# EAGLE design sensorbridge (EAGLE 8.2.2)
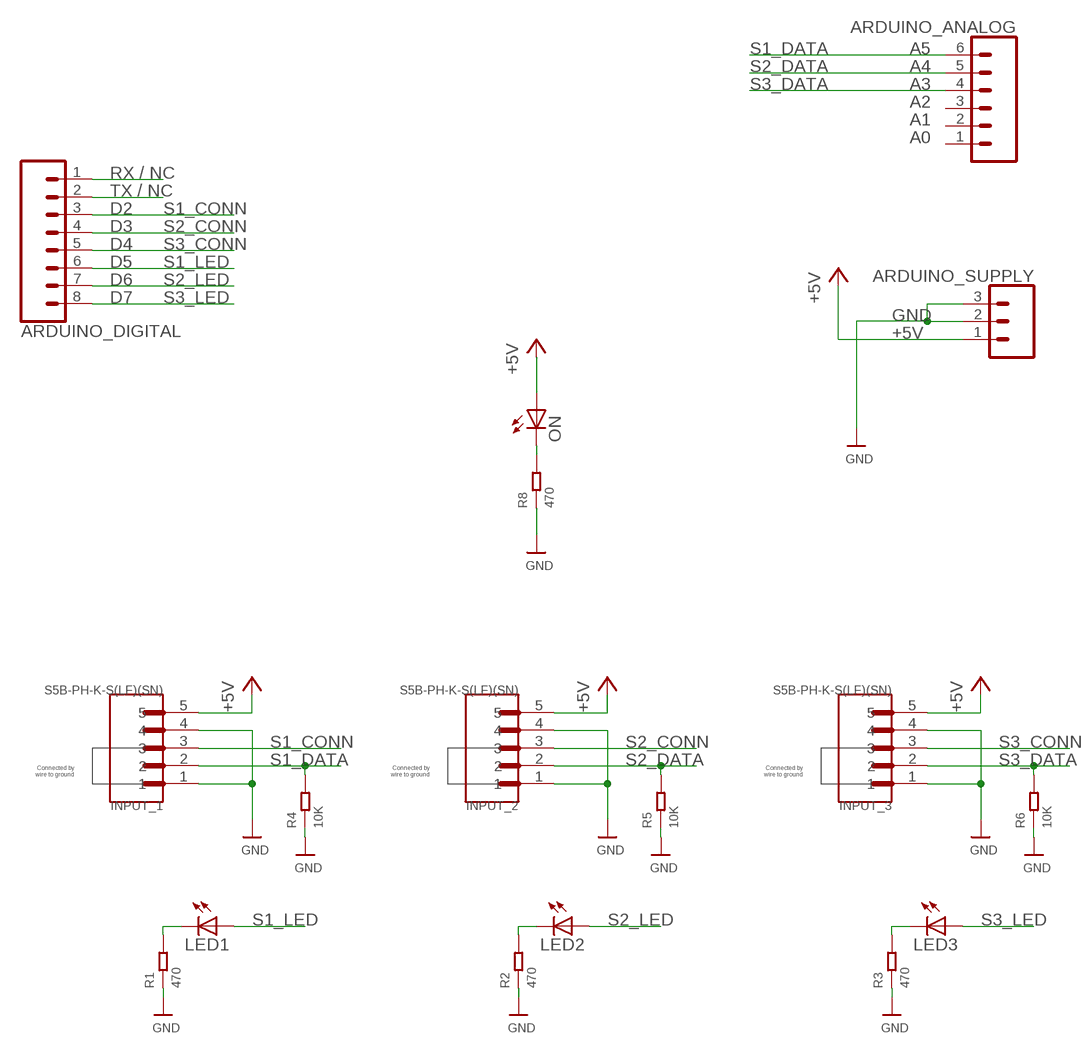
[diagram p0: schematic, sheet 1]

## Parts
ARDUINO_ANALOG  CONN_06NO_SILK_FEMALE_PTH  [1X06_NO_SILK]
ARDUINO_DIGITAL  CONN_08NO_SILK_FEMALE_PTH  [1X08_NO_SILK]
ARDUINO_SUPPLY  CONN_031X03_NO_SILK  [1X03_NO_SILK]
INPUT_1  S5B-PH-K-S(LF)(SN)  [JST_S5B-PH-K-S(LF)(SN)]
INPUT_2  S5B-PH-K-S(LF)(SN)  [JST_S5B-PH-K-S(LF)(SN)]
INPUT_3  S5B-PH-K-S(LF)(SN)  [JST_S5B-PH-K-S(LF)(SN)]
LED1  LEDCHIP-LED0603  [CHIP-LED0603]
LED2  LEDCHIP-LED0603  [CHIP-LED0603]
LED3  LEDCHIP-LED0603  [CHIP-LED0603]
ON  LEDCHIP-LED0603  [CHIP-LED0603]
R1  470  RES-0603  [R0603]
R2  470  RES-0603  [R0603]
R3  470  RES-0603  [R0603]
R4  10K  RES-0603  [R0603]
R5  10K  RES-0603  [R0603]
R6  10K  RES-0603  [R0603]
R8  470  RES-0603  [R0603]

## Nets
+5V: ARDUINO_SUPPLY.1 INPUT_1.5 INPUT_2.5 INPUT_3.5 ON.A
GND: ARDUINO_SUPPLY.2 ARDUINO_SUPPLY.3 INPUT_1.1 INPUT_1.4 INPUT_2.1 INPUT_2.4 INPUT_3.1 INPUT_3.4 R1.1 R2.1 R3.1 R4.1 R5.1 R6.1 R8.1
N$1: LED1.C R1.2
N$2: LED2.C R2.2
N$3: LED3.C R3.2
N$9: ON.C R8.2
N$12: ARDUINO_DIGITAL.2
N$13: ARDUINO_DIGITAL.1
S1_CONN: ARDUINO_DIGITAL.3 INPUT_1.3
S1_DATA: ARDUINO_ANALOG.6 INPUT_1.2 R4.2
S1_LED: ARDUINO_DIGITAL.6 LED1.A
S2_CONN: ARDUINO_DIGITAL.4 INPUT_2.3
S2_DATA: ARDUINO_ANALOG.5 INPUT_2.2 R5.2
S2_LED: ARDUINO_DIGITAL.7 LED2.A
S3_CONN: ARDUINO_DIGITAL.5 INPUT_3.3
S3_DATA: ARDUINO_ANALOG.4 INPUT_3.2 R6.2
S3_LED: ARDUINO_DIGITAL.8 LED3.A
Unconnected: ARDUINO_ANALOG.1 ARDUINO_ANALOG.2 ARDUINO_ANALOG.3

## Notes on the sheet
- A5
- A4
- A3
- A2
- A1
- A0
- RX / NC
- TX / NC
- D2
- D3
- D4
- D5
- D6
- D7
- Connected by
  wire to ground
- Connected by
  wire to ground
- Connected by
  wire to ground

## Library data of the parts
ARDUINO_ANALOG = SparkFun-Connectors:CONN_06: Multi connection point. Often used as Generic Header-pin footprint for 0.1 inch spaced/style header connections On any of the 0.1 inch spaced packages, you can populate with these: Break Away Headers - Straight <https://www.sparkfun.com/products/116> (PRT-00116) Break Away Male Headers - Right Angle <https://www.sparkfun.com/products/553> (PRT-00553) Female Headers <https://www.sparkfun.com/products/115> (PRT-00115) Break Away Headers - Machine Pin <https://www.sparkfun.com/products/117> (PRT-00117) Break Away Female Headers - Swiss Machine Pin <https://www.sparkfun.com/products/743> (PRT-00743) Arduino Stackable Header - 6 Pin <https://www.sparkfun.com/products/9280> (PRT-09280) For SCREWTERMINALS and SPRING TERMINALS visit here: Screw Terimnals on SparkFun.com <https://www.sparkfun.com/search/results?term=Screw+Terminals> (5mm/3.5mm/2.54mm spacing) This device is also useful as a general connection point to wire up your design to another part of your project. Our various solder wires solder well into these plated through hole pads. Hook-Up Wire - Assortment (Stranded, 22 AWG) <https://www.sparkfun.com/products/11375> (PRT-11375) Hook-Up Wire - Assortment (Solid Core, 22 AWG) <https://www.sparkfun.com/products/11367> (PRT-11367) View the entire wire category on our website here <https://www.sparkfun.com/categories/141>; PROD_ID: CONN-08437
ARDUINO_DIGITAL = SparkFun-Connectors:CONN_08: Multi connection point. Often used as Generic Header-pin footprint for 0.1 inch spaced/style header connections On any of the 0.1 inch spaced packages, you can populate with these: Break Away Headers - Straight <https://www.sparkfun.com/products/116> (PRT-00116) Break Away Male Headers - Right Angle <https://www.sparkfun.com/products/553> (PRT-00553) Female Headers <https://www.sparkfun.com/products/115> (PRT-00115) Break Away Headers - Machine Pin <https://www.sparkfun.com/products/117> (PRT-00117) Break Away Female Headers - Swiss Machine Pin <https://www.sparkfun.com/products/743> (PRT-00743) Arduino Stackable Header - 8 Pin <https://www.sparkfun.com/products/9279> (PRT-09279) For SCREWTERMINALS and SPRING TERMINALS visit here: Screw Terimnals on SparkFun.com <https://www.sparkfun.com/search/results?term=Screw+Terminals> (5mm/3.5mm/2.54mm spacing) This device is also useful as a general connection point to wire up your design to another part of your project. Our various solder wires solder well into these plated through hole pads. Hook-Up Wire - Assortment (Stranded, 22 AWG) <https://www.sparkfun.com/products/11375> (PRT-11375) Hook-Up Wire - Assortment (Solid Core, 22 AWG) <https://www.sparkfun.com/products/11367> (PRT-11367) View the entire wire category on our website here <https://www.sparkfun.com/categories/141> Special notes: Molex polarized connector foot print use with SKU : PRT-08231 with associated crimp pins and housings. 1MM SMD Version SKU: PRT-10208 NOTES ON THE VARIANTS LOCK and LOCK_LONGPADS... This footprint was designed to help hold the alignment of a through-hole component (i.e. 6-pin header) while soldering it into place. You may notice that each hole has been shifted either up or down by 0.005 of an inch from it's more standard position (which is a perfectly straight line). This slight alteration caused the pins (the squares in the middle) to touch the edges of the holes. Because they are alternating, it causes a "brace" to hold the component in place. 0.005 has proven to be the perfect amount of "off-center" position when using our standard breakaway headers. Although looks a little odd when you look at the bare footprint, once you have a header in there, the alteration is very hard to notice. Also,if you push a header all the way into place, it is covered up entirely on the bottom side.; PROD_ID: CONN-08438
ARDUINO_SUPPLY = SparkFun-Connectors:CONN_03: Multi connection point. Often used as Generic Header-pin footprint for 0.1 inch spaced/style header connections On any of the 0.1 inch spaced packages, you can populate with these: Break Away Headers - Straight <https://www.sparkfun.com/products/116> (PRT-00116) Break Away Male Headers - Right Angle <https://www.sparkfun.com/products/553> (PRT-00553) Female Headers <https://www.sparkfun.com/products/115> (PRT-00115) Break Away Headers - Machine Pin <https://www.sparkfun.com/products/117> (PRT-00117) Break Away Female Headers - Swiss Machine Pin <https://www.sparkfun.com/products/743> (PRT-00743) Stackable Header - 3 Pin (Female, 0.1") <https://www.sparkfun.com/products/13875> (PRT-13875) For SCREWTERMINALS and SPRING TERMINALS visit here: Screw Terimnals on SparkFun.com <https://www.sparkfun.com/search/results?term=Screw+Terminals> (5mm/3.5mm/2.54mm spacing) This device is also useful as a general connection point to wire up your design to another part of your project. Our various solder wires solder well into these plated through hole pads. Hook-Up Wire - Assortment (Stranded, 22 AWG) <https://www.sparkfun.com/products/11375> (PRT-11375) Hook-Up Wire - Assortment (Solid Core, 22 AWG) <https://www.sparkfun.com/products/11367> (PRT-11367) View the entire wire category on our website here <https://www.sparkfun.com/categories/141> Special notes: Molex polarized connector foot print use with SKU : PRT-08232 with associated crimp pins and housings.
INPUT_1-INPUT_3 = S5B-PH-K-S_LF__SN_:S5B-PH-K-S(LF)(SN): PH Series 5 Position 2 mm Pitch Through Hole Side Entry Shrouded Header; AVAILABILITY: Good; DESCRIPTION: PH Series 5 Position 2 mm Pitch Through Hole Side Entry Shrouded Header; MF: JST; MP: S5B-PH-K-S(LF)(SN); PACKAGE: None; PRICE: 0.15 USD
LED1-LED3 ON = adafruit:LED: LED OSRAM: - CHIPLED LG R971, LG N971, LY N971, LG Q971, LY Q971, LO R971, LY R971 LH N974, LH R974 LS Q976, LO Q976, LY Q976 LO Q996 - Hyper CHIPLED LW Q18S LB Q993, LB Q99A, LB R99A - SideLED LS A670, LO A670, LY A670, LG A670, LP A670 LB A673, LV A673, LT A673, LW A673 LH A674 LY A675 LS A676, LA A676, LO A676, LY A676, LW A676 LS A679, LY A679, LG A679 - Hyper Micro SIDELED® LS Y876, LA Y876, LO Y876, LY Y876 LT Y87S - SmartLED LW L88C, LW L88S LB L89C, LB L89S, LG L890 LS L89K, LO L89K, LY L89K LS L896, LA L896, LO L896, LY L896 - TOPLED LS T670, LO T670, LY T670, LG T670, LP T670 LSG T670, LSP T670, LSY T670, LOP T670, LYG T670 LG T671, LOG T671, LSG T671 LB T673, LV T673, LT T673, LW T673 LH T674 LS T676, LA T676, LO T676, LY T676, LB T676, LH T676, LSB T676, LW T676 LB T67C, LV T67C, LT T67C, LS T67K, LO T67K, LY T67K, LW E67C LS E67B, LA E67B, LO E67B, LY E67B, LB E67C, LV E67C, LT E67C LW T67C LS T679, LY T679, LG T679 LS T770, LO T770, LY T770, LG T770, LP T770 LB T773, LV T773, LT T773, LW T773 LH T774 LS E675, LA E675, LY E675, LS T675 LS T776, LA T776, LO T776, LY T776, LB T776 LHGB T686 LT T68C, LB T68C - Hyper Mini TOPLED® LB M676 - Mini TOPLED Santana® LG M470 LS M47K, LO M47K, LY M47K Source: http://www.osram.convergy.de/
R1-R6 R8 = Seeed-OPL-Resistor:RES

## Board
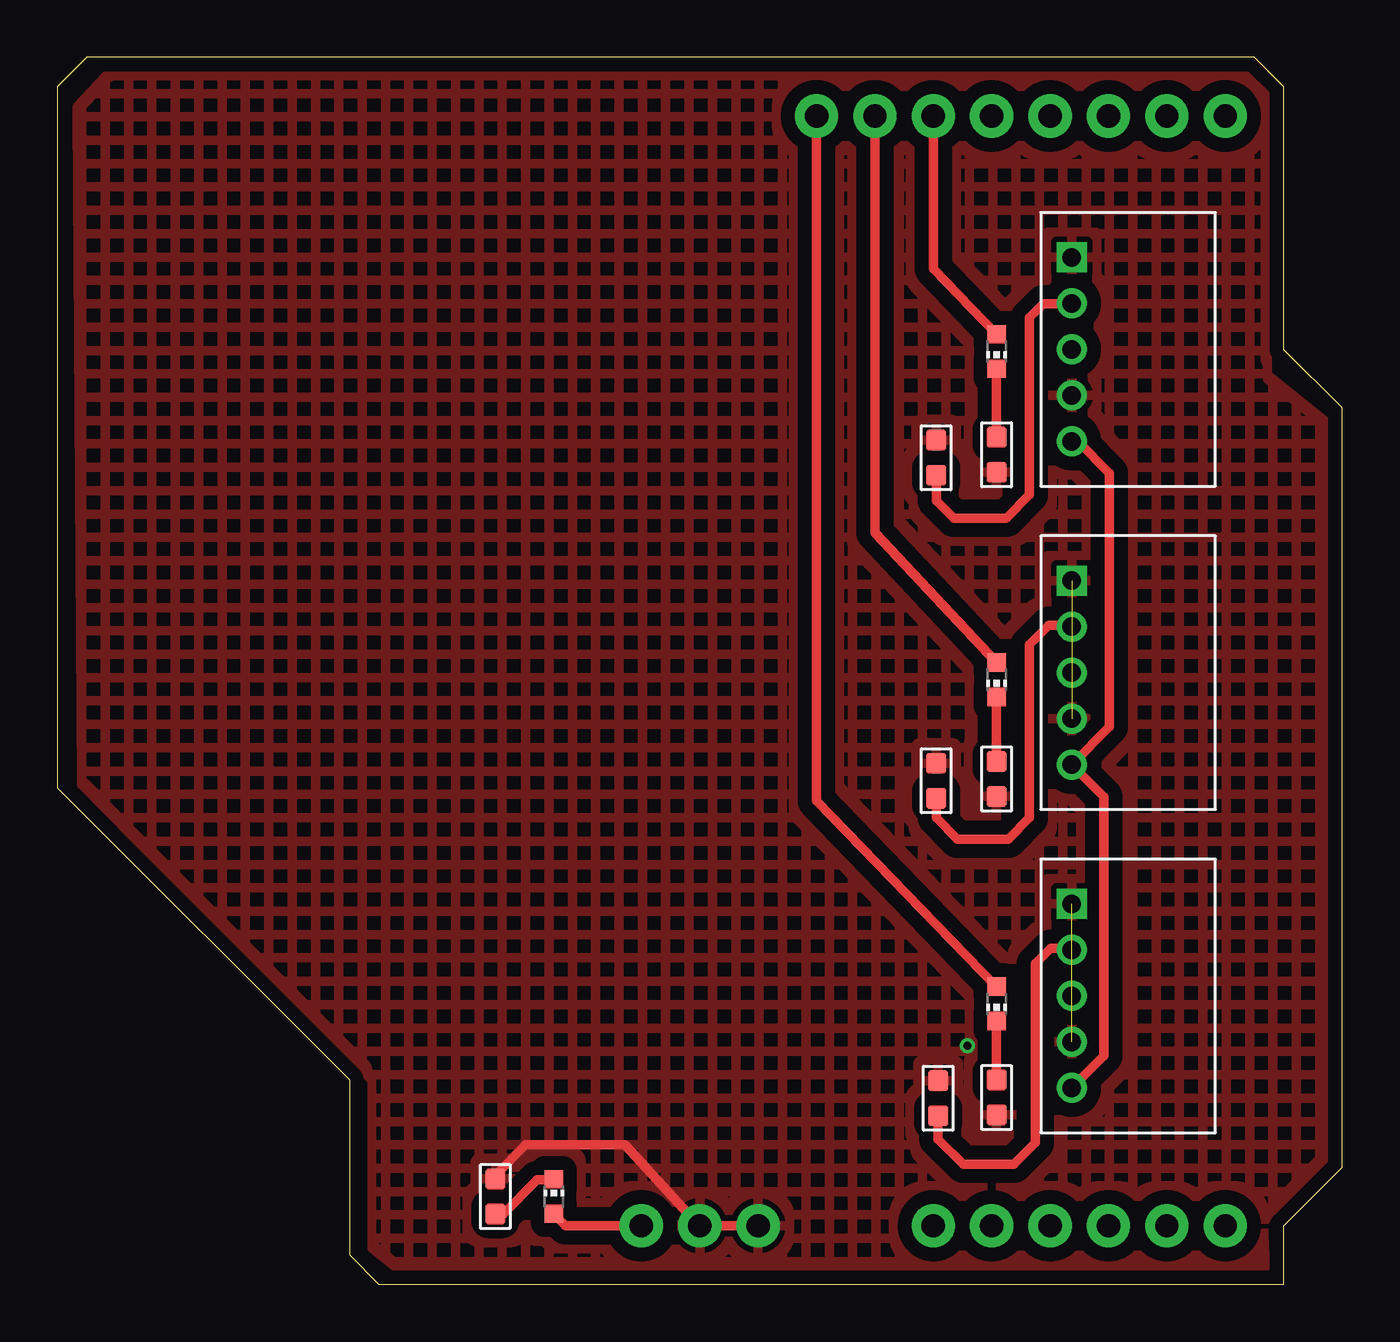
[diagram p1: board, top side]
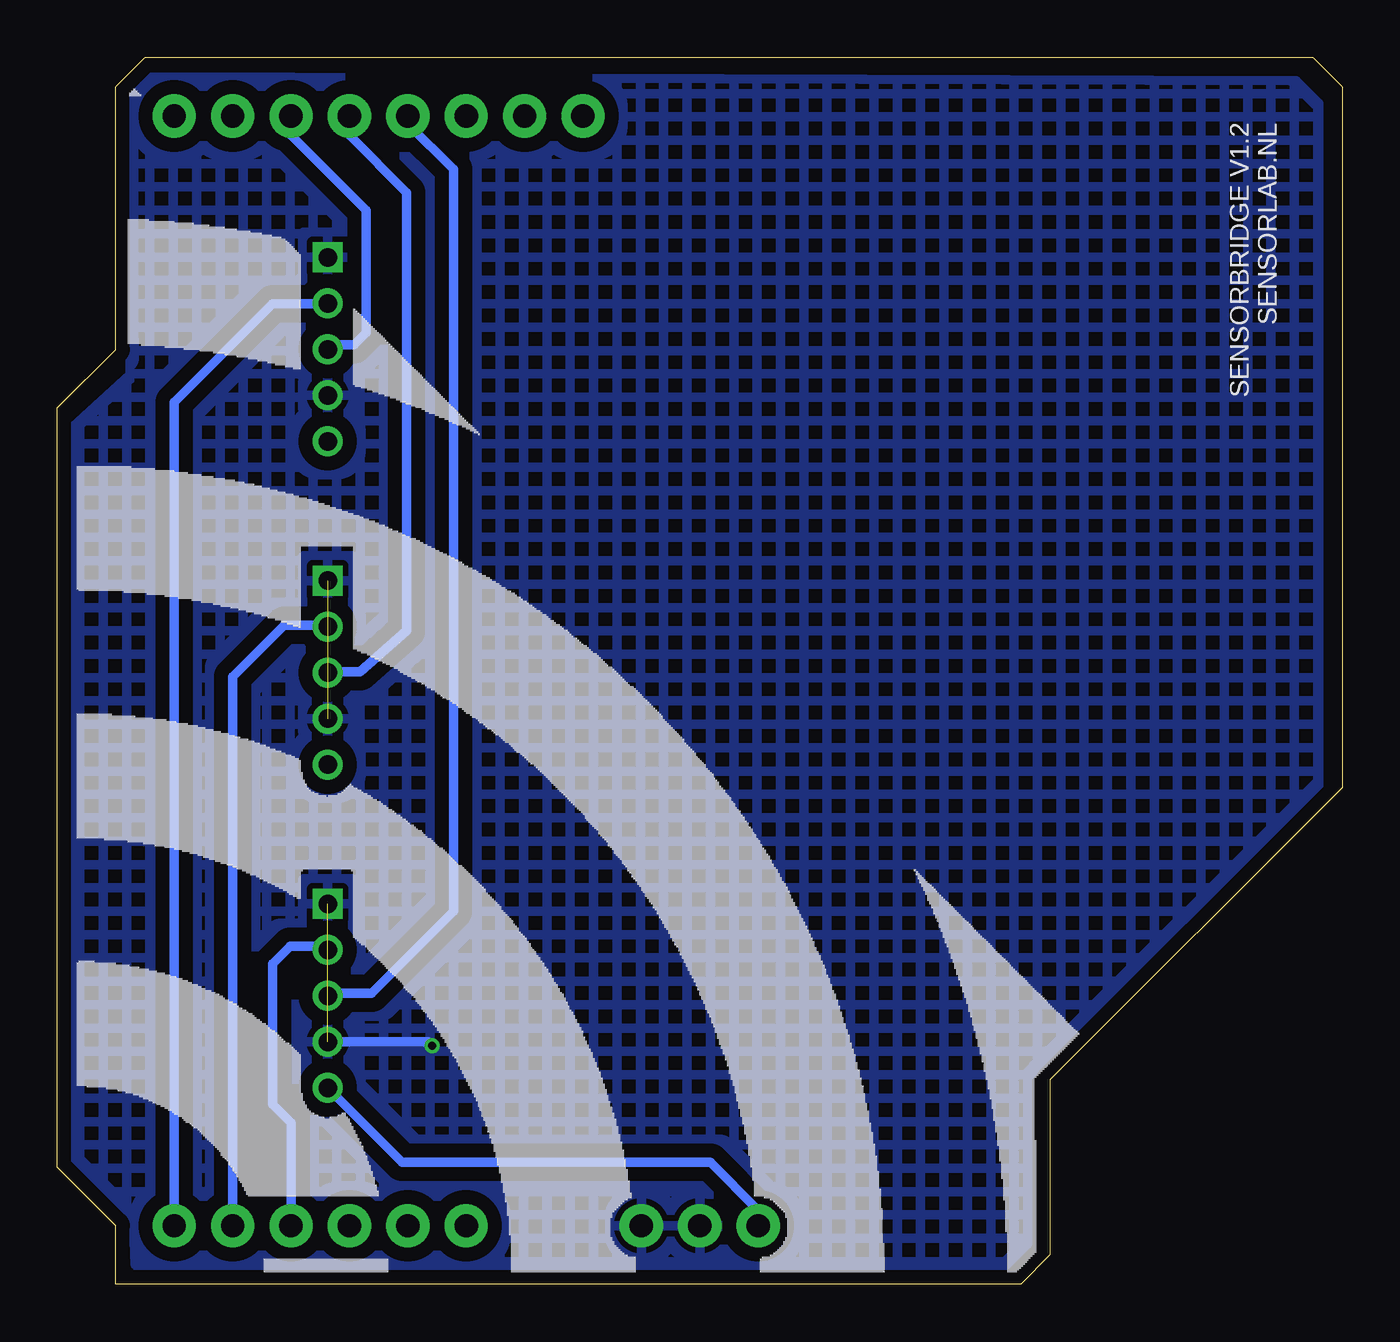
[diagram p2: board, bottom side, seen from below]

Size 55.88 x 53.34 mm. Coordinates in mm from the lower left corner, seen from the top.
Outline: 13.97,0 53.34,0 53.34,2.54 55.88,5.08 55.88,38.1 53.34,40.64 53.34,52.07 52.07,53.34 1.27,53.34 0,52.07 0,21.59 12.7,8.89 12.7,1.27 13.97,0
Copper layers (1*16): Top 0.035mm / dielectric 1.5mm / Bottom 0.035mm
Design rules "dirt_cheap_dirty_boards.v1": minimum track width 5mil, minimum drill 12mil, track to track 5mil, track to pad 5mil, pad to pad 5mil, via to via 5mil, smd to smd 0mil, copper to edge 10mil, drill to drill 10mil, minimum pad ring 10mil, minimum via ring 6mil, stop-mask expansion 2mil, vias tented up to drill 25mil, thermal gap 10mil

### Footprints (pad centres in the part's own frame; a part is rotated, then mirrored left to right if it is on the bottom)
1X06_NO_SILK = drill 1.016 pad 1.88: 1 0,0; 2 2.54,0; 3 5.08,0; 4 7.62,0; 5 10.16,0; 6 12.7,0
1X08_NO_SILK = drill 1.016 pad 1.88: 1 0,0; 2 2.54,0; 3 5.08,0; 4 7.62,0; 5 10.16,0; 6 12.7,0; 7 15.24,0; 8 17.78,0
1X03_NO_SILK = drill 1.016 pad 1.88: 1 0,0; 2 2.54,0; 3 5.08,0
JST_S5B-PH-K-S(LF)(SN) = drill 0.8 square: 1 4,0 | drill 0.8: 2 2,0; 3 0,0; 4 -2,0; 5 -4,0
CHIP-LED0603 = smd 0.8 x 0.8: A 0,-0.75; C 0,0.75
R0603 = smd 0.889 x 0.889: 1 0,0.762; 2 0,-0.762

### Placement (x,y rotation side)
ARDUINO_ANALOG  38.1,2.54 0 top
ARDUINO_DIGITAL  50.8,50.8 180 top
ARDUINO_SUPPLY  25.4,2.54 0 top
INPUT_1  44.12,40.65 90 top
INPUT_2  44.12,26.59 90 top
INPUT_3  44.12,12.53 90 top
LED1  40.85,40.56 180 top
LED2  40.85,26.28 180 top
LED3  40.85,12.18 180 top
ON  21.59,3.81 0 top
R1  40.85,36.07 180 top
R2  40.85,21.97 180 top
R3  40.85,8.12 180 top
R4  38.23,35.94 0 top
R5  38.23,21.88 0 top
R6  38.31,8.08 0 top
R8  19.05,3.81 0 top

### Tracks (layer width: path | path; a pad name or v marks a point on that pad's centre or on a via)
+5V
  Top 0.406: ARDUINO_SUPPLY.1 22.11,2.54 ON.A | INPUT_1.5 44.38,36.65 45.76,35.26 45.76,24.23 INPUT_2.5 45.51,21.2 45.51,9.92 INPUT_3.5
  Bottom 0.406: ARDUINO_SUPPLY.1 25.4,3.21 27.48,5.29 40.88,5.29 INPUT_3.5
GND  (via drill 0.35)  (2 unrouted)
  Top 0.406: ARDUINO_SUPPLY.3 ARDUINO_SUPPLY.2 27.48,3 27.48,3.01 24.68,6.05 20.36,6.05 19.05,4.74 R8.1
  Bottom 0.406: INPUT_3.4 39.74,10.53 v39.58,10.37
  pour Top (isolate 0.61, hatched): 0.85,51.19 2.12,52.55 51.74,52.55 52.89,51.4 52.63,39.55 55.3,37.39 55.3,5.5 52.46,2.67 52.55,0.76 14.99,0.51 13.68,1.57 13.68,8.85 1.06,21.72 0.85,50.89
  pour Bottom (isolate 0.61, hatched): 1.02,51.36 1.99,52.33 51.79,52.5 52.72,51.49 52.72,39.55 55.22,37.26 55.34,5.63 55.05,5.34 52.59,2.88 52.51,0.85 52.42,0.76 47.98,0.72 14.91,0.51 13.68,1.74 13.68,8.98 1.02,21.64
N$1
  Top 0.406: LED1.C R1.2
N$2
  Top 0.406: LED2.C R2.2
N$3
  Top 0.406: LED3.C R3.2
N$9
  Top 0.406: R8.2 19.39,3.05 20.87,4.53 21.56,4.53 ON.C
S1_CONN
  Bottom 0.406: ARDUINO_DIGITAL.3 45.72,49.95 42.46,46.69 42.46,41.36 42.97,40.85 43.92,40.85 INPUT_1.3
S1_DATA
  Top 0.406: R4.2 38.23,34.07 38.99,33.31 41.27,33.31 42.29,34.33 42.29,42.03 42.88,42.63 44.1,42.63 INPUT_1.2
  Bottom 0.406: ARDUINO_ANALOG.6 50.8,38.36 46.53,42.63 44.14,42.63 INPUT_1.2
S1_LED
  Top 0.406: ARDUINO_DIGITAL.6 38.1,44.14 LED1.A
S2_CONN
  Bottom 0.406: ARDUINO_DIGITAL.4 43.18,49.95 40.68,47.46 40.68,28.41 42.72,26.63 44.09,26.63 INPUT_2.3
S2_DATA
  Top 0.406: R5.2 38.23,20.28 39.16,19.34 41.36,19.34 42.29,20.28 42.29,27.81 43.14,28.66 44.06,28.66 INPUT_2.2
  Bottom 0.406: ARDUINO_ANALOG.5 48.26,26.42 46.02,28.66 44.19,28.66 INPUT_2.2
S2_LED
  Top 0.406: ARDUINO_DIGITAL.7 35.56,32.67 LED2.A
S3_CONN
  Bottom 0.406: ARDUINO_DIGITAL.5 40.64,50.46 38.65,48.47 38.65,16.21 42.21,12.66 44,12.66 INPUT_3.3
S3_DATA
  Top 0.406: R6.2 38.31,6.31 39.41,5.21 41.61,5.21 42.54,6.14 42.54,13.93 43.22,14.6 44.05,14.6 INPUT_3.2
  Bottom 0.406: ARDUINO_ANALOG.4 45.72,7.02 46.53,7.83 46.53,13.93 45.76,14.69 44.28,14.69 INPUT_3.2
S3_LED
  Top 0.406: ARDUINO_DIGITAL.8 33.02,21.02 LED3.A

### Text on the board
BOTTOMsilk: SENSORBRIDGE V1.2 / SENSORLAB.NL